# Altium schematic sheet RECEPTOR_AIS_PWR_R00.SchDoc
size A4; SheetNumber: 5; SheetTotal: 5
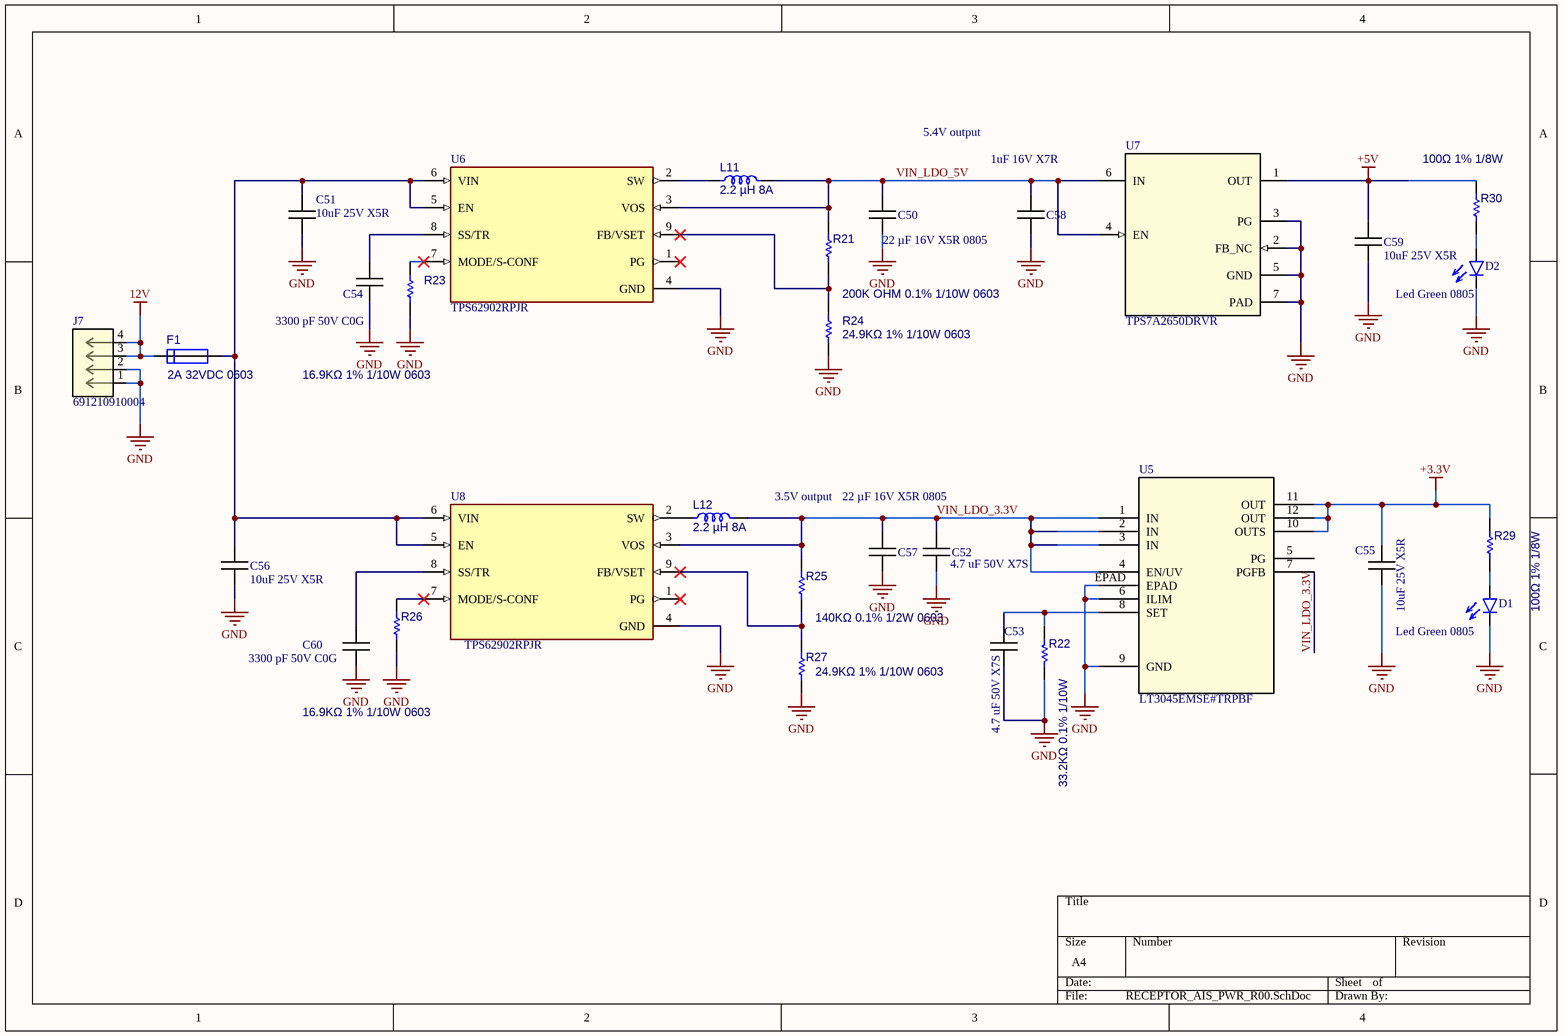
[diagram p0: RECEPTOR_AIS_PWR_R00.SchDoc]

## Parts
C50  22 µF 16V X5R 0805  [C_0805]
C51  10uF 25V X5R  [C_0805]
C52  4.7 uF 50V X7S  [C_0805]
C53  4.7 uF 50V X7S  [C_0805]
C54  3300 pF 50V C0G  [C_0603]
C55  10uF 25V X5R  [C_0805]
C56  10uF 25V X5R  [C_0805]
C57  22 µF 16V X5R 0805  [C_0805]
C58  1uF 16V X7R  [C_0603]
C59  10uF 25V X5R  [C_0805]
C60  3300 pF 50V C0G  [C_0603]
D1  Led Green 0805  [LED_0805]
D2  Led Green 0805  [LED_0805]
F1  2A 32VDC 0603  [0603_AVX-M]
J7  691210910004  [691210910004]
L11  2.2 µH 8A  [INDPM6965X240N]
L12  2.2 µH 8A  [INDPM6965X240N]
R21  200K OHM 0.1% 1/10W 0603  [R_0603]
R22  33.2KΩ 0.1% 1/10W  [R_0603]
R23  16.9KΩ 1% 1/10W 0603  [R_0603]
R24  24.9KΩ 1% 1/10W 0603  [R_0603]
R25  140KΩ 0.1% 1/2W 0603  [R_0603]
R26  16.9KΩ 1% 1/10W 0603  [R_0603]
R27  24.9KΩ 1% 1/10W 0603  [R_0603]
R29  100Ω 1% 1/8W  [R_0603]
R30  100Ω 1% 1/8W  [R_0603]
U5  LT3045EMSE#TRPBF  [12-MSOP-EP]
U6  TPS62902RPJR  [FP-RPJ0009A-MFG]
U7  TPS7A2650DRVR  [DRV0006A_NV]
U8  TPS62902RPJR  [FP-RPJ0009A-MFG]

## Nets
12V: F1.1 J7.3 J7.4
+3.3V: C55.2 R29.2 U5.10(OUTS) U5.11(OUT) U5.12(OUT)
+5V: C59.2 R30.2 U7.1(OUT)
GND: C50.1 C51.1 C52.1 C53.1 C54.1 C55.1 C56.1 C57.1 C58.1 C59.1 C60.1 D1.2(K) D2.2(K) J7.1 J7.2 R22.1 R23.1 R24.1 R26.1 R27.1 U5.6(ILIM) U5.9(GND) U5.EPAD U6.4(GND) U7.2(FB_NC) U7.3(PG) U7.5(GND) U7.7(PAD) U8.4(GND)
VIN_LDO_3.3V: C52.2 C57.2 L12.2 R25.2 U5.1(IN) U5.2(IN) U5.3(IN) U5.4(EN/UV) U5.7(PGFB) U8.3(VOS)
VIN_LDO_5V: C50.2 C58.2 L11.2 R21.2 U6.3(VOS) U7.4(EN) U7.6(IN)
NetC51_2: C51.2 C56.2 F1.2 U6.5(EN) U6.6(VIN) U8.5(EN) U8.6(VIN)
NetC53_2: C53.2 R22.2 U5.8(SET)
NetC54_2: C54.2 U6.8(SS/TR)
NetC60_2: C60.2 U8.8(SS/TR)
NetD1_1: D1.1(A) R29.1
NetD2_1: D2.1(A) R30.1
NetL11_1: L11.1 U6.2(SW)
NetL12_1: L12.1 U8.2(SW)
NetR21_1: R21.1 R24.2 U6.9(FB/VSET)
NetR23_2: R23.2 U6.7(MODE/S-CONF)
NetR25_1: R25.1 R27.2 U8.9(FB/VSET)
NetR26_2: R26.2 U8.7(MODE/S-CONF)

Not connected (* = marked no-connect by the designer): U5 5(PG); U6 1(PG)*; U8 1(PG)*

## Notes on the sheet
- 5.4V output
- 3.5V output

## Library data of the parts
C50 C57 = Capacitor NP: 22 µF ±20% 16V Ceramic Capacitor X5R 0805 (2012 Metric)
C51 C55 C56 C59 = Capacitor NP: 10 µF ±10% 25V Ceramic Capacitor X5R 0805 (2012 Metric)
C52 C53 = Capacitor NP: 4.7 µF ±10% 50V Ceramic Capacitor X7S 0805 (2012 Metric)
C54 C60 = Capacitor NP: 3300 pF ±1% 50V Ceramic Capacitor C0G, NP0 0603 (1608 Metric)
C58 = Capacitor NP: 1 µF ±5% 16V Ceramic Capacitor X7R 0603 (1608 Metric)
D1 D2 = Led: Green 569nm LED Indication - Discrete 2.1V 0805 (2012 Metric)
F1 = FUSIBLE: 2 A 32 V Fuse Board Mount (Cartridge Style Excluded) Surface Mount 0603 (1608 Metric)
J7 = Conn_1x4_WE: WR-TBL Terminal block - Screwless Push IN - THT; Manufacturer_Name: Wurth Electronics; Manufacturer_Part_Number: 691412320004; Copyright: Copyright (C) 2025 Ultra Librarian. All rights reserved.; RefDes: RefDes; Type: Type
L11 L12 = IND: IHLP2525CZER2R2M01 - 2.2 µH Shielded Molded Inductor 8 A 20mOhm Max Nonstandard
R21 = Res1: 200 kOhms ±0.1% 0.1W, 1/10W Chip Resistor 0603 (1608 Metric) Thin Film
R22 = Res1: 33.2 kOhms ±0.1% 0.1W, 1/10W Chip Resistor 0603 (1608 Metric) Thin Film
R23 R26 = Res1: 16.9 kOhms ±0.1% 0.1W, 1/10W Chip Resistor 0603 (1608 Metric) Thin Film
R24 R27 = Res1: 24.9 kOhms ±0.1% 0.1W, 1/10W Chip Resistor 0603 (1608 Metric) Thin Film
R25 = Res1: 140 kOhms ±1% 0.5W, 1/2W Chip Resistor 0603 (1608 Metric) Automotive AEC-Q200, Pulse Withstanding Thick Film
R29 R30 = Res1: 100 Ohms ±0.1% 1/8W Chip Resistor 0603 (1608 Metric) Thin Film
U5 = LT3045EMSETRPBF: 20V, 500mA, Ultralow Noise, Ultrahigh PSRR Linear Regulator; Manufacturer_Name: Analog Devices Inc; Copyright: Copyright (C) 2026 Ultra Librarian. All rights reserved.; Manufacturer_Part_Number: LT3045EMSE#TRPBF; RefDes: RefDes; Type: Type
U6 U8 = TPS62902RPJR: TPS62902RPJR 3-V TO 17-V, 2-A, HIGH-EFFICIENC; Manufacturer Part Number: TPS62902RPJR
U7 = TPS7A2650DRVR: 500-mA, 18-V, ultra-low-IQ, high-accuracy, adjustable low-dropout voltage regulator with power good 6-WSON -40 to 125; Manufacturer_Name: Texas Instruments; TYPE: TYPE; RefDes: RefDes; Copyright: Copyright (C) 2025 Ultra Librarian. All rights reserved.; Manufacturer_Part_Number: TPS7A2650DRVR